# EAGLE design 2KbeaconDetectorV1.1 (EAGLE 9.6.2)
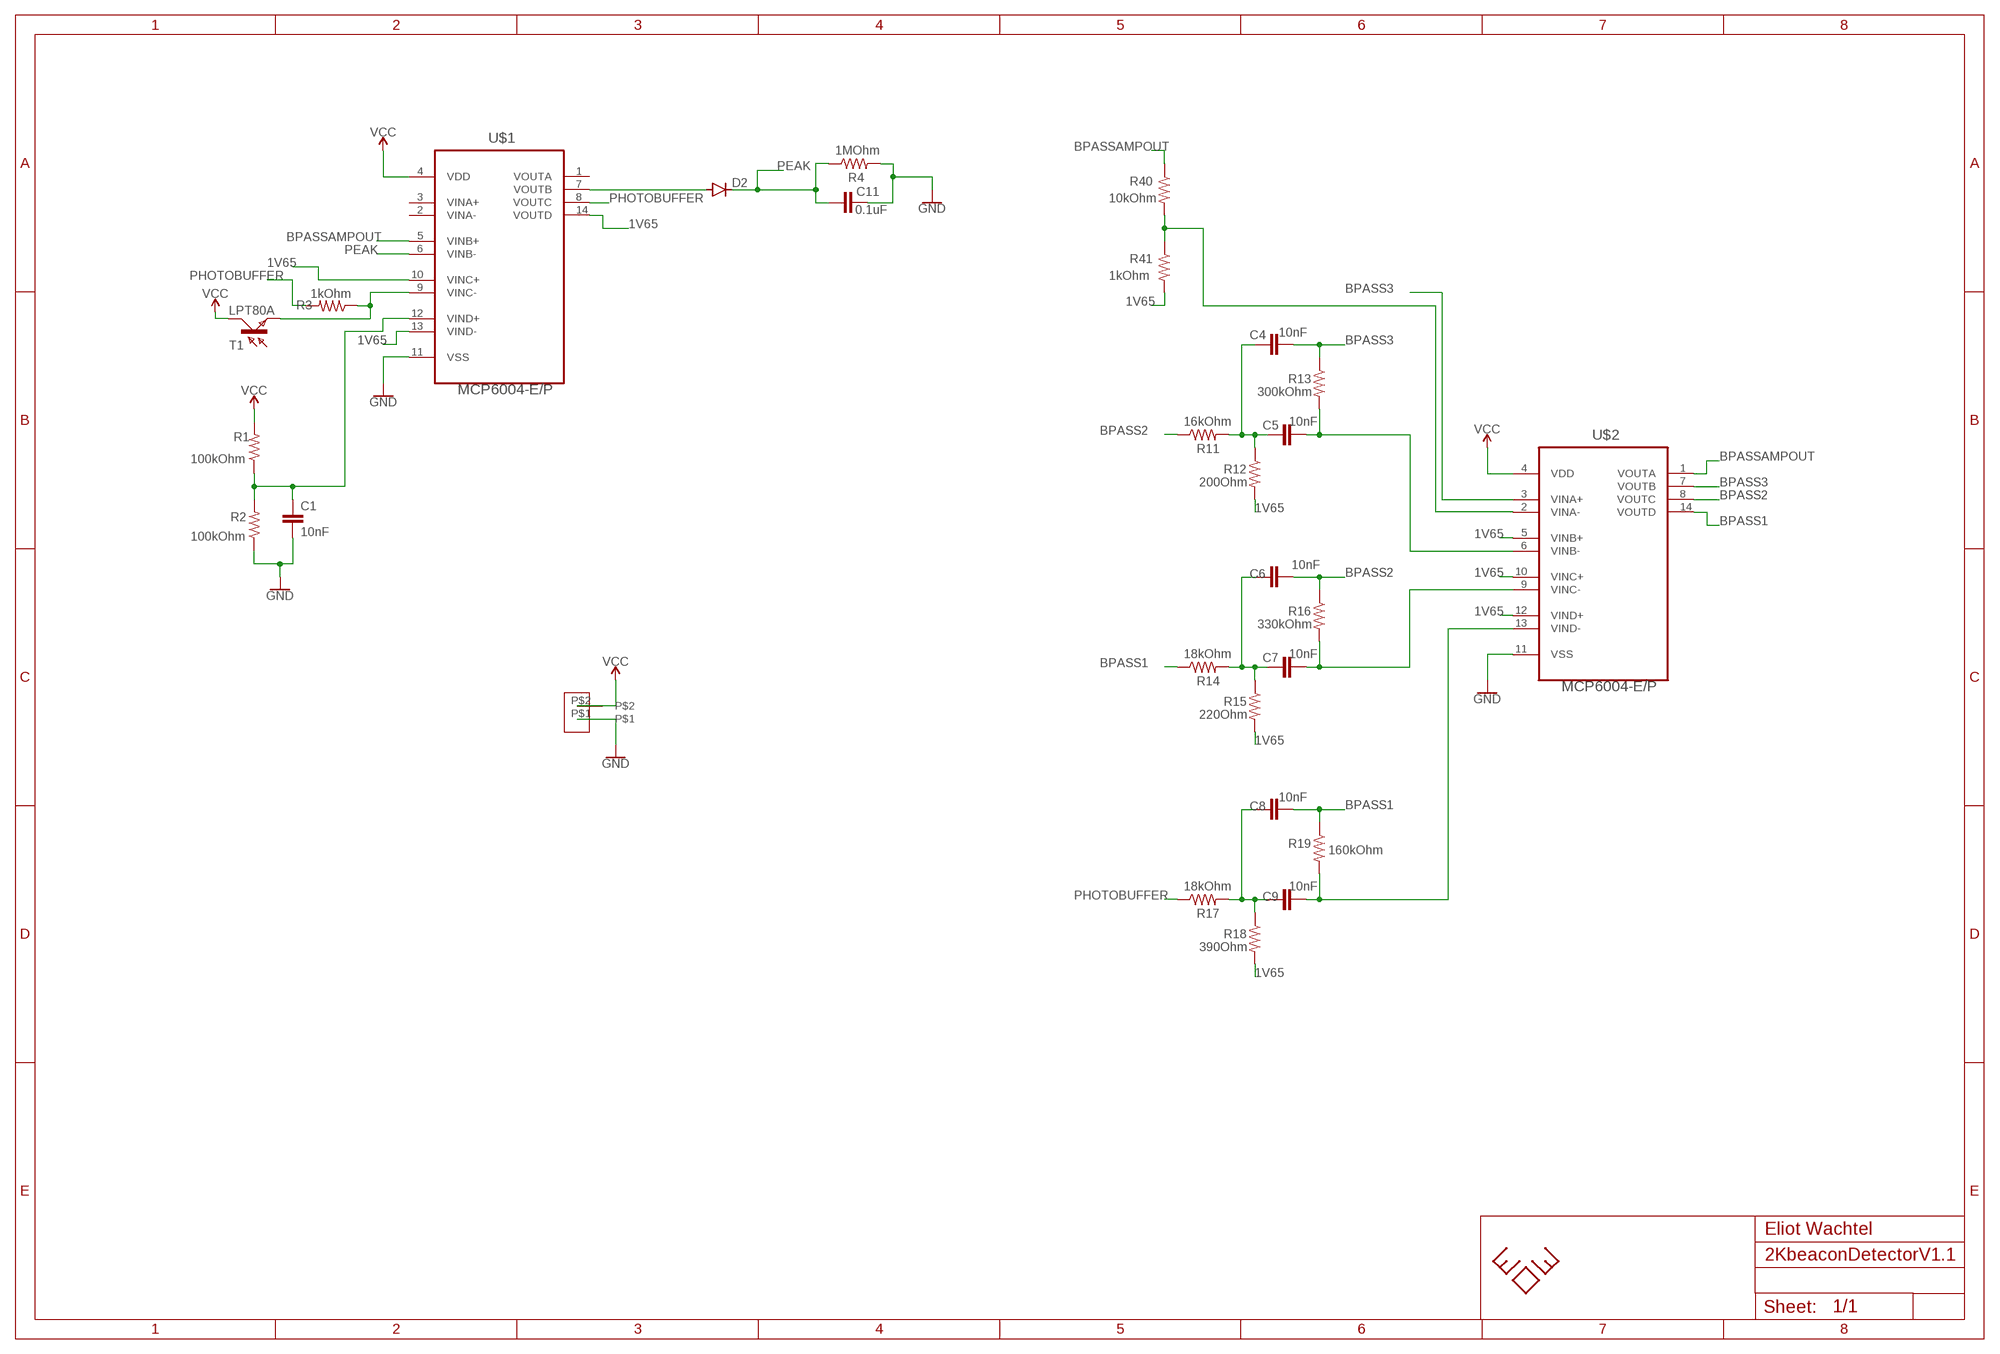
[diagram p0: schematic, sheet 1]

## Parts
C1  10nF  C5/2.5  [C5B2.5]
C4  10nF  C5/2.5  [C5B2.5]
C5  10nF  C5/2.5  [C5B2.5]
C6  10nF  C5/2.5  [C5B2.5]
C7  10nF  C5/2.5  [C5B2.5]
C8  10nF  C5/2.5  [C5B2.5]
C9  10nF  C5/2.5  [C5B2.5]
C11  0.1uF  C5/2.5  [C5B2.5]
D2  DIODE-D-7.5  [D-7.5]
R1  100kOhm  R-US_0204/5  [0204/5]
R2  100kOhm  R-US_0204/2V  [0204V]
R3  1kOhm  R-US_0204/2V  [0204V]
R4  1MOhm  R-US_0204/5  [0204/5]
R11  16kOhm  R-US_0204/5  [0204/5]
R12  200Ohm  R-US_0204/7  [0204/7]
R13  300kOhm  R-US_0204/2V  [0204V]
R14  18kOhm  R-US_0204/5  [0204/5]
R15  220Ohm  R-US_0204/7  [0204/7]
R16  330kOhm  R-US_0204/2V  [0204V]
R17  18kOhm  R-US_0204/5  [0204/5]
R18  390Ohm  R-US_0204/5  [0204/5]
R19  160kOhm  R-US_0204/2V  [0204V]
R40  10kOhm  R-US_0204/7  [0204/7]
R41  1kOhm  R-US_0204/7  [0204/7]
T1  LPT80A  [LPT80A]
U$1  MCP6004-E/P  [DIP254P762X533-14]
U$2  MCP6004-E/P  [DIP254P762X533-14]
U$4  WIRECONNECT2PIN  [WIRECONNECT2PIN]

## Nets
1V65: R12.2 R15.2 R18.2 R41.2 U$1.10(VINC+) U$1.13(VIND-) U$1.14(VOUTD) U$2.5(VINB+) U$2.10(VINC+) U$2.12(VIND+)
BPASS1: C8.2 R14.1 R19.1 U$2.14(VOUTD)
BPASS2: C6.2 R11.1 R16.1 U$2.8(VOUTC)
BPASS3: C4.2 R13.1 U$2.3(VINA+) U$2.7(VOUTB)
BPASSAMPOUT: R40.1 U$1.5(VINB+) U$2.1(VOUTA)
GND: C1.2 C11.2 R2.1 R4.2 U$1.11(VSS) U$2.11(VSS) U$4.P$1
N$1: C1.1 R1.1 R2.2 U$1.12(VIND+)
N$2: D2.A U$1.7(VOUTB)
N$5: R3.1 T1.E U$1.9(VINC-)
N$8: C4.1 C5.1 R11.2 R12.1
N$9: C7.2 R16.2 U$2.9(VINC-)
N$10: C6.1 C7.1 R14.2 R15.1
N$11: C9.2 R19.2 U$2.13(VIND-)
N$12: C8.1 C9.1 R17.2 R18.1
N$13: C5.2 R13.2 U$2.6(VINB-)
N$25: R40.2 R41.1 U$2.2(VINA-)
PEAK: C11.1 D2.C R4.1 U$1.6(VINB-)
PHOTOBUFFER: R3.2 R17.1 U$1.8(VOUTC)
VCC: R1.2 T1.C U$1.4(VDD) U$2.4(VDD) U$4.P$2
Unconnected: U$1.1(VOUTA) U$1.2(VINA-) U$1.3(VINA+)

## Notes on the sheet
- Eliot Wachtel

## Library data of the parts
C1 C4-C9 C11 = capacitor-wima:C: CAPACITOR naming: grid - package width
D2 = diode:DIODE-: DIODE
R1-R4 R11-R19 R40 R41 = adafruit:R-US_: RESISTOR, American symbol
T1 = opto-trans-siemens:LPT80A: PHOTO TRANSISTOR; OC_FARNELL: unknown; OC_NEWARK: unknown
U$1 U$2 = MCP6004-E_P:MCP6004-E/P: 1 MHz, Low-Power Op Amp; DESCRIPTION: Op Amp Quad Low Power Amplifier R-R I/O 6V Automotive 14-Pin PDIP Tube; DIGI-KEY_PART_NUMBER: MCP6004-E/P-ND; MF: Microchip Technology; MP: MCP6004-E/P; PACKAGE: DIP-14 Microchip; PURCHASE-URL: https://pricing.snapeda.com/search/part/MCP6004-E/P/?ref=eda
U$4 = connectors:WIRECONNECT2PIN

## Board
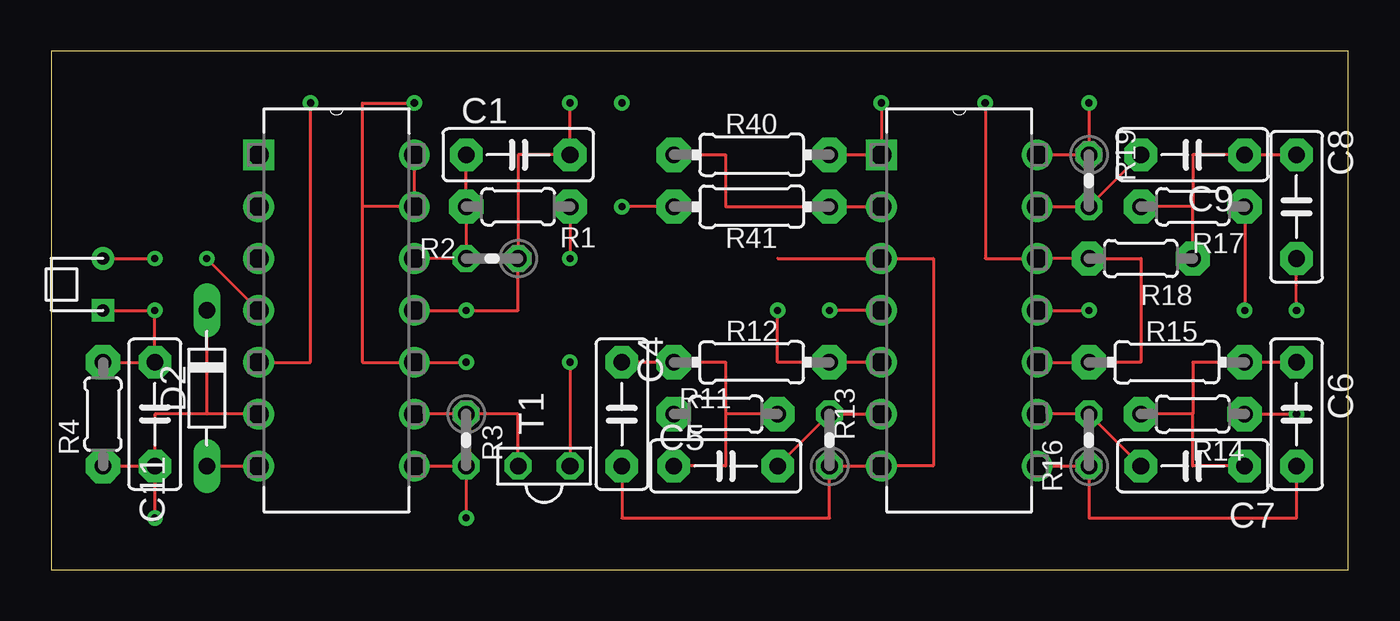
[diagram p1: board, top side]
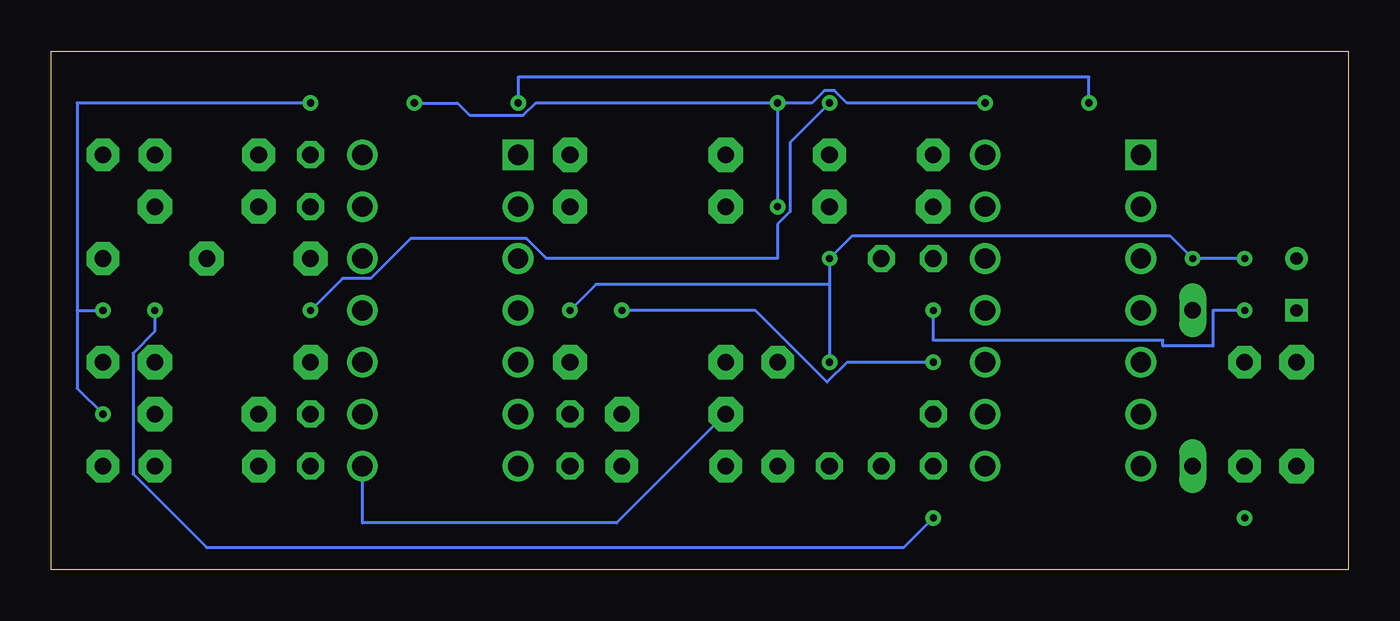
[diagram p2: board, bottom side, seen from below]

Size 63.5 x 25.4 mm. Coordinates in mm from the lower left corner, seen from the top.
Outline: 0,0 63.5,0 63.5,25.4 0,25.4 0,0
Copper layers (1*16): Top 0.035mm / dielectric 1.5mm / Bottom 0.035mm
Design rules "default": minimum track width 6mil, minimum drill 0.35mm, track to track 6mil, track to pad 6mil, pad to pad 6mil, via to via 6mil, smd to smd 6mil, copper to edge 40mil, drill to drill 6mil, minimum pad ring 10mil, minimum via ring 8mil, stop-mask expansion 4mil, vias tented up to drill 0mil, thermal gap 10mil

### Footprints (pad centres in the part's own frame; a part is rotated, then mirrored left to right if it is on the bottom)
C5B2.5 = drill 0.813 pad 1.6 octagon: 1 -2.54,0; 2 2.54,0
D-7.5 = drill 0.813 long: A 3.81,0; C -3.81,0
0204/5 = drill 0.813 pad 1.676 octagon: 1 -2.54,0; 2 2.54,0
0204V = drill 0.813 octagon: 1 -1.27,0; 2 1.27,0
0204/7 = drill 0.813 pad 1.676 octagon: 1 -3.81,0; 2 3.81,0
LPT80A = drill 0.813 octagon: C 0,-1.27; E 0,1.27
DIP254P762X533-14 = drill 0.991 square: 1 -7.62,15.24 | drill 0.991: 2 -7.62,12.7; 3 -7.62,10.16; 4 -7.62,7.62; 5 -7.62,5.08; 6 -7.62,2.54; 7 -7.62,0; 8 0,0; 9 0,2.54; 10 0,5.08; 11 0,7.62; 12 0,10.16; 13 0,12.7; 14 0,15.24
WIRECONNECT2PIN = drill 0.6 square: P$1 2.54,0 | drill 0.6: P$2 2.54,2.54

### Placement (x,y rotation side)
C1  22.86,20.32 0 top
C4  27.94,7.62 270 top
C5  33.02,5.08 0 top
C6  60.96,7.62 270 top
C7  55.88,5.08 180 top
C8  60.96,17.78 270 top
C9  55.88,20.32 180 top
C11  5.08,7.62 90 top
D2  7.62,8.89 270 top
R1  22.86,17.78 0 top
R2  21.59,15.24 180 top
R3  20.32,6.35 270 top
R4  2.54,7.62 90 top
R11  33.02,7.62 0 top
R12  34.29,10.16 0 top
R13  38.1,6.35 90 top
R14  55.88,7.62 180 top
R15  54.61,10.16 180 top
R16  50.8,6.35 90 top
R17  55.88,17.78 180 top
R18  53.34,15.24 180 top
R19  50.8,19.05 270 top
R40  34.29,20.32 180 top
R41  34.29,17.78 180 top
T1  24.13,5.08 90 top
U$1  17.78,5.08 0 top
U$2  48.26,5.08 0 top
U$4  0,12.7 0 top

### Tracks (layer width: path | path; a pad name or v marks a point on that pad's centre or on a via)
1V65  (via drill 0.35)
  Top 0.152: U$1.14 U$1.13 15.24,17.78 | 15.24,17.78 15.24,10.16 U$1.10 v20.32,10.16 | U$2.10 R15.2 53.34,10.16 53.34,15.24 R18.2 U$2.12 45.72,15.24 v45.72,22.86 | R41.2 v27.94,17.78 | U$2.5 R12.2 35.56,10.16 v35.56,12.7 | 15.24,17.78 15.24,22.86 v17.78,22.86
  Bottom 0.152: v45.72,22.86 43.61,22.86 43,22.25 40.39,22.25 39.78,22.86 v27.94,22.86 | v17.78,22.86 24.54,22.86 25.15,23.47 25.65,23.47 26.26,22.86 v27.94,22.86 | v27.94,22.86 v27.94,17.78 | v35.56,12.7 29.02,12.7 25.51,9.19 24.54,10.16 v20.32,10.16
BPASS1  (via drill 0.35)
  Top 0.152: R14.1 v60.96,7.62 | U$2.14 R19.1 v50.8,22.86 | v60.96,12.7 C8.2
  Bottom 0.152: v50.8,22.86 62.23,22.86 62.23,12.7 | 62.23,12.7 v60.96,12.7 | 62.23,12.7 62.23,8.89 v60.96,7.62
BPASS2
  Top 0.152: C6.2 60.96,2.54 50.8,2.54 R16.1 U$2.8
  Bottom 0.152: U$2.8 48.26,2.29 35.81,2.29 R11.1
BPASS3
  Top 0.152: 35.56,15.24 U$2.3 43.18,15.24 43.18,5.08 U$2.7 R13.1 38.1,2.54 27.94,2.54 C4.2
BPASSAMPOUT  (via drill 0.35)
  Top 0.152: U$1.5 12.7,10.16 v12.7,22.86 | v40.64,22.86 U$2.1 R40.1
  Bottom 0.152: v12.7,22.86 12.7,24.13 40.64,24.13 v40.64,22.86
GND  (via drill 0.35)
  Top 0.152: R4.2 C11.2 v5.08,12.7 U$4.P$1 | U$1.11 v20.32,12.7 22.86,12.7 R2.1 22.86,20.32 C1.2 v25.4,22.86 | U$2.11 v50.8,12.7
  Bottom 0.152: v5.08,12.7 6.63,12.7 6.63,10.95 9.08,10.95 9.08,11.24 20.32,11.24 v20.32,12.7 | v25.4,22.86 27.33,20.93 27.33,17.53 27.94,16.92 27.94,15.24 39.26,15.24 40.23,16.22 45.9,16.22 47.85,14.26 49.24,14.26 v50.8,12.7
N$1
  Top 0.152: U$1.12 R2.2 R1.1 C1.1
N$2
  Top 0.152: D2.A U$1.7
N$5
  Top 0.152: T1.E 22.86,7.62 R3.1 U$1.9
N$8
  Top 0.152: R11.2 33.02,7.62 | 33.02,7.62 33.02,10.16 R12.1 C4.1 | 33.02,7.62 33.02,5.08 C5.1
N$9
  Top 0.152: U$2.9 R16.2 C7.2
N$10
  Top 0.152: 55.88,7.62 R14.2 | C7.1 55.88,5.08 55.88,7.62 | C6.1 R15.1 55.88,10.16 55.88,7.62
N$11
  Top 0.152: U$2.13 R19.2 C9.2
N$12
  Top 0.152: 55.88,17.78 55.88,20.32 C9.1 C8.1 | 55.88,17.78 R17.2 | R18.1 55.88,17.78
N$13
  Top 0.152: U$2.6 R13.2 C5.2
N$25
  Top 0.152: U$2.2 R41.1 33.02,17.78 33.02,20.32 R40.2
PEAK  (via drill 0.35)
  Top 0.152: R4.1 C11.1 | D2.C 7.62,7.62 | 7.62,7.62 5.08,7.62 C11.1 | U$1.6 7.62,7.62 | C11.1 v5.08,2.54
PHOTOBUFFER  (via drill 0.35)
  Top 0.152: R17.1 v58.42,12.7 | U$1.8 R3.2 v20.32,2.54
  Bottom 0.152: v58.42,12.7 58.42,11.67 59.49,10.6 59.49,4.69 55.89,1.09 21.77,1.09 v20.32,2.54
VCC  (via drill 0.35)
  Top 0.152: R1.2 v25.4,15.24 | v25.4,10.16 T1.C | U$1.4 v7.62,15.24 | U$2.4 v38.1,12.7 | U$4.P$2 v5.08,15.24
  Bottom 0.152: v25.4,15.24 24.28,16.36 8.74,16.36 v7.62,15.24 v5.08,15.24 | v38.1,12.7 36.83,13.97 25.4,13.97 v25.4,15.24 | v25.4,15.24 v25.4,10.16